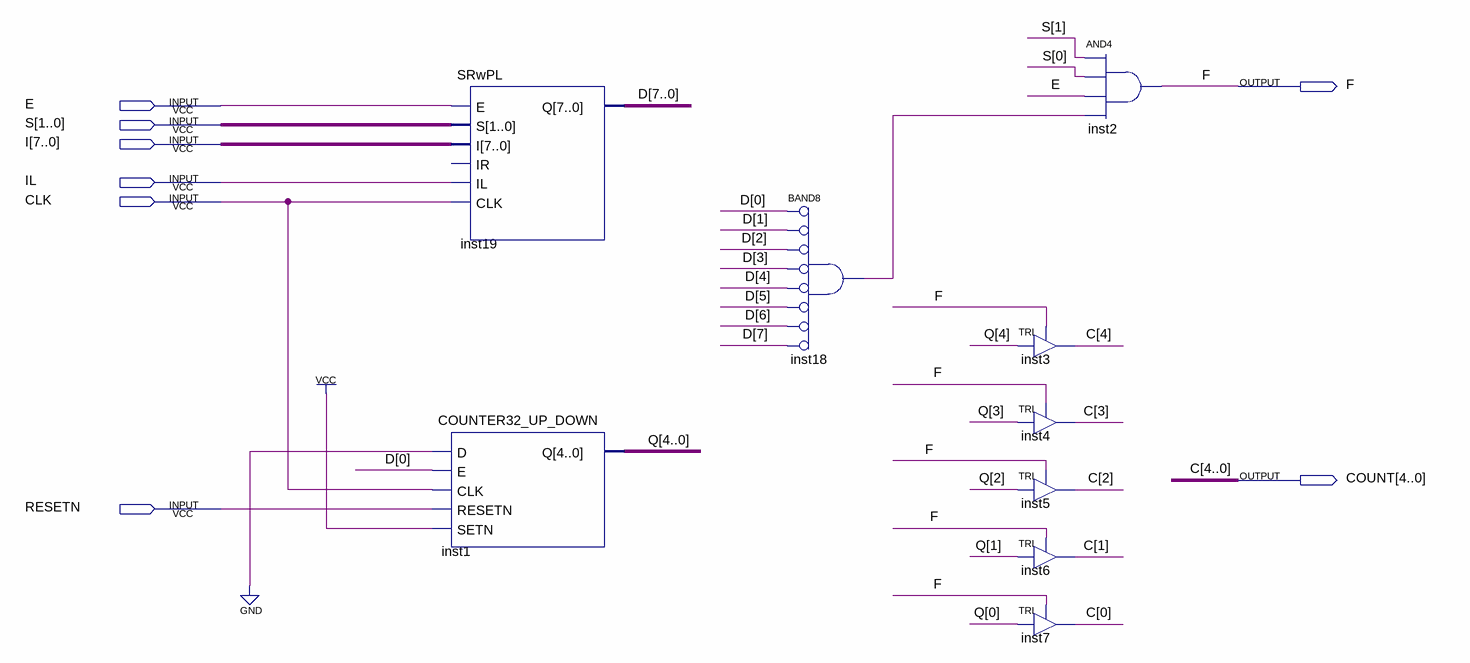
[diagram p0: schematic sheet]
// Quartus schematic One_Counter.bdf as structural Verilog: 9 symbols, 8 pins
module One_Counter (
  input  E,
  input  [1:0] S,
  input  [7:0] I,
  input  IL,
  input  CLK,
  input  RESETN,
  output F,
  output [4:0] COUNT
);

  wire inst18_out;
  wire [4:0] Q;
  wire [7:0] D;

  COUNTER32_UP_DOWN inst1 (.D(1'b0), .E(D[0]), .CLK(CLK), .RESETN(RESETN), .SETN(1'b1), .Q(Q));
  SRwPL inst19 (.E(E), .S(S), .I(I), .IL(IL), .CLK(CLK), .Q(D));  // open: IR
  and inst18 (inst18_out, ~D[0], ~D[1], ~D[2], ~D[3], ~D[4], ~D[5], ~D[6], ~D[7]);  // BAND8
  TRI inst3 (.IN(Q[4]), .OE(F), .OUT(COUNT[4]));
  TRI inst4 (.IN(Q[3]), .OE(F), .OUT(COUNT[3]));
  TRI inst5 (.IN(Q[2]), .OE(F), .OUT(COUNT[2]));
  TRI inst6 (.IN(Q[1]), .OE(F), .OUT(COUNT[1]));
  TRI inst7 (.IN(Q[0]), .OE(F), .OUT(COUNT[0]));
  and inst2 (F, S[1], S[0], E, inst18_out);

  // Other names for the same wires on the sheet: C[4:0] = COUNT
endmodule
